# Altium project STM32MP15XXAD_LPDDR2x16.PrjPcb
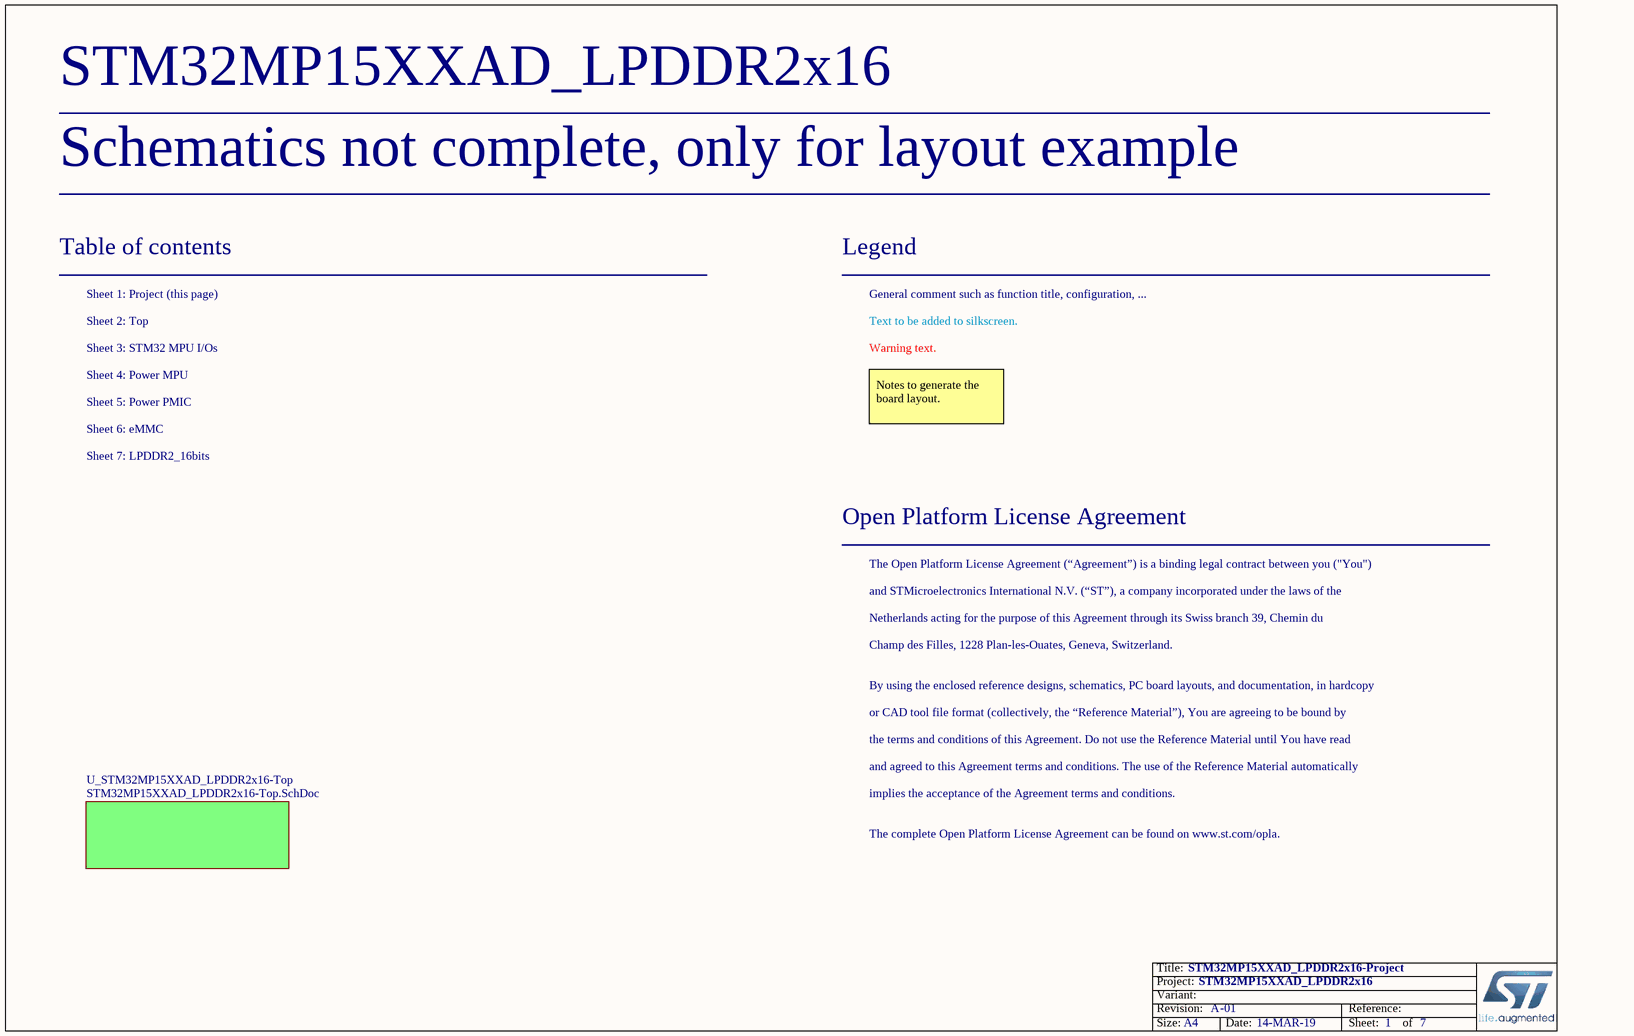
[diagram p0: STM32MP15XXAD_LPDDR2x16-Project.SchDoc]
Board_Assembly_Revision: 01; Board_Document_Date: 14-MAR-19; Board_Name: STM32MP15XXAD_LPDDR2x16; Board_PCB_Revision: A
7 sheets, 88 parts. Net scope: flat (ports and power ports of the same name join across sheets).
Board file: STM32MP15XXAD_1LPDDR2x16_A01.PcbDoc
Sheets:
  STM32MP15XXAD_LPDDR2x16-Project.SchDoc
    U_STM32MP15XXAD_LPDDR2x16-Top = STM32MP15XXAD_LPDDR2x16-Top.SchDoc
      U_Power_PMIC = Power_PMIC.SchDoc
      U_Power_MPU = Power_MPU.SchDoc
      U_eMMC = eMMC.SchDoc
      U_STM32_MPU_IOs = STM32_MPU_IOs.SchDoc
      U_LPDDR2_16bits = LPDDR2_16bits .SchDoc

## Sheet STM32MP15XXAD_LPDDR2x16-Project.SchDoc: STM32MP15XXAD_LPDDR2x16-Project
size A4; ApprovedBy: Not used; CheckedBy: Not used; Author: Not used; CompanyName: STMicroelectronics; DrawnBy: Not used; Engineer: Not used; Organization: Not used; Address1: Not used; Address2: Not used; Address3: Not used; Address4: Not used; DocumentNumber: Not used; Revision: Not used; SheetNumber: 1; SheetTotal: 7; CurrentTime: Not used; CurrentDate: Not used; Time: Not used; DocumentFullPathAndName: Not used; DocumentName: Not used; ModifiedDate: Not used; ImagePath: Not used; ProjectName: Not used; Application_BuildNumber: Not used

### Sub-sheets
U_STM32MP15XXAD_LPDDR2x16-Top = STM32MP15XXAD_LPDDR2x16-Top.SchDoc: no entries

### Notes on the sheet
- Schematics not complete, only for layout example
- Table of contents
- Sheet 1: Project (this page)
- Legend
- General comment such as function title, configuration, ...
- Sheet 2: Top
- Sheet 3: STM32 MPU I/Os
- Sheet 4: Power MPU
- Text to be added to silkscreen.
- Warning text.
- Sheet 5: Power PMIC
- Sheet 6: eMMC
- Notes to generate the board layout.
- Sheet 7: LPDDR2_16bits
- Open Platform License Agreement
- The Open Platform License Agreement (“Agreement”) is a binding legal contract between you ("You")
- and STMicroelectronics International N.V. (“ST”), a company incorporated under the laws of the
- Netherlands acting for the purpose of this Agreement through its Swiss branch 39, Chemin du
- Champ des Filles, 1228 Plan-les-Ouates, Geneva, Switzerland.
- By using the enclosed reference designs, schematics, PC board layouts, and documentation, in hardcopy
- or CAD tool file format (collectively, the “Reference Material”), You are agreeing to be bound by
- the terms and conditions of this Agreement. Do not use the Reference Material until You have read
- and agreed to this Agreement terms and conditions. The use of the Reference Material automatically
- implies the acceptance of the Agreement terms and conditions.
- The complete Open Platform License Agreement can be found on www.st.com/opla.
- Title:
- Project:
- Size:
- Revision:
- Variant:
- A4
- -
- Date:
- Reference:
- Sheet:
- of

## Sheet STM32MP15XXAD_LPDDR2x16-Top.SchDoc: STM32MP15XXAD_LPDDR2x16-TOP
size A4; Date: Not used; ApprovedBy: Not used; CheckedBy: Not used; Author: Not used; CompanyName: STMicroelectronics; DrawnBy: Not used; Engineer: Not used; Organization: Not used; Address1: Not used; Address2: Not used; Address3: Not used; Address4: Not used; DocumentNumber: Not used; Revision: Not used; SheetNumber: 2; SheetTotal: 7; CurrentTime: Not used; CurrentDate: Not used; Time: Not used; DocumentFullPathAndName: Not used; DocumentName: Not used; ModifiedDate: Not used; ImagePath: Not used; ProjectName: Not used; Application_BuildNumber: Not used
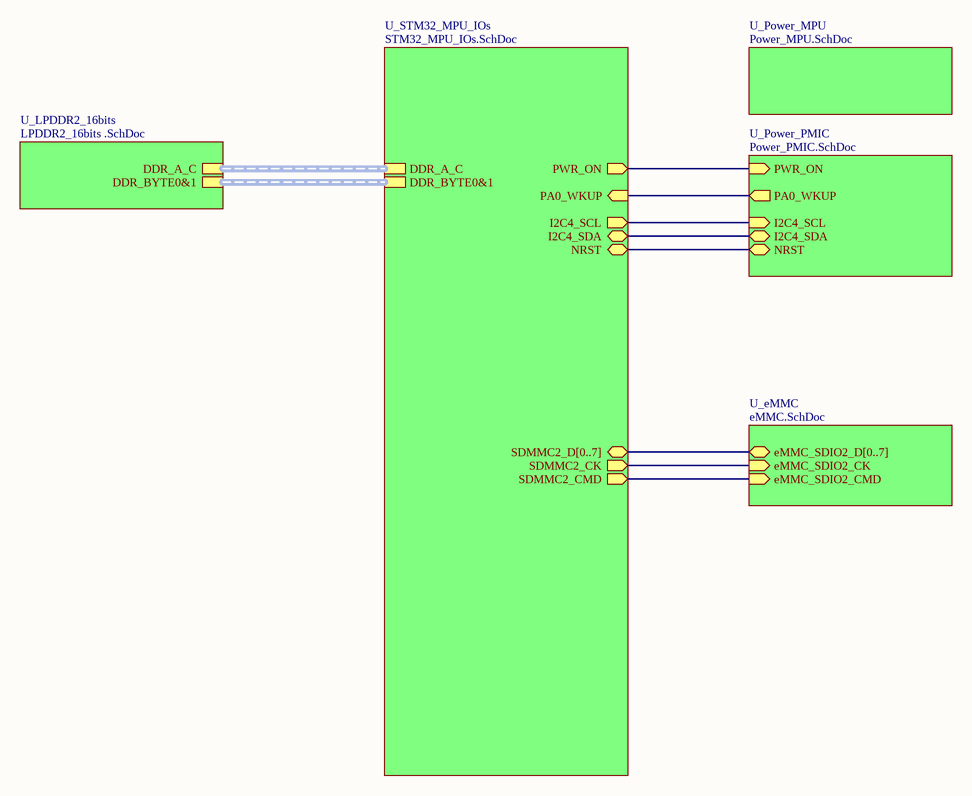
[diagram p1: STM32MP15XXAD_LPDDR2x16-Top.SchDoc]

### Sub-sheets
U_eMMC = eMMC.SchDoc: eMMC_SDIO2_CK (in), eMMC_SDIO2_D[0..7] (bidir), eMMC_SDIO2_CMD (in)
U_LPDDR2_16bits = LPDDR2_16bits .SchDoc: DDR_A_C (harness DDR_A_C), DDR_BYTE0&1 (harness DDR_BYTE_0&1)
U_Power_MPU = Power_MPU.SchDoc: no entries
U_Power_PMIC = Power_PMIC.SchDoc: I2C4_SDA (bidir), I2C4_SCL (in), PA0_WKUP (out), NRST (bidir), PWR_ON (in)
U_STM32_MPU_IOs = STM32_MPU_IOs.SchDoc: PA0_WKUP (in), NRST (bidir), PWR_ON (out), I2C4_SCL (out), I2C4_SDA (bidir), DDR_BYTE0&1 (harness DDR_BYTE_0&1), DDR_A_C (harness DDR_A_C), SDMMC2_D[0..7] (bidir), SDMMC2_CMD (out), SDMMC2_CK (out)

### Nets
(unnamed): sheet U_Power_PMIC/I2C4_SDA, sheet U_STM32_MPU_IOs/I2C4_SDA
(unnamed): sheet U_Power_PMIC/I2C4_SCL, sheet U_STM32_MPU_IOs/I2C4_SCL
(unnamed): sheet U_Power_PMIC/PA0_WKUP, sheet U_STM32_MPU_IOs/PA0_WKUP
(unnamed): sheet U_Power_PMIC/NRST, sheet U_STM32_MPU_IOs/NRST
(unnamed): sheet U_Power_PMIC/PWR_ON, sheet U_STM32_MPU_IOs/PWR_ON
(unnamed): sheet U_eMMC/eMMC_SDIO2_CK, sheet U_STM32_MPU_IOs/SDMMC2_CK
(unnamed): sheet U_eMMC/eMMC_SDIO2_CMD, sheet U_STM32_MPU_IOs/SDMMC2_CMD

### Buses and harness runs
bus sheet U_eMMC/eMMC_SDIO2_D[0..7] = sheet U_STM32_MPU_IOs/SDMMC2_D[0..7]
harness sheet U_LPDDR2_16bits/DDR_A_C = sheet U_STM32_MPU_IOs/DDR_A_C
harness sheet U_LPDDR2_16bits/DDR_BYTE0&1 = sheet U_STM32_MPU_IOs/DDR_BYTE0&1

### Notes on the sheet
- Title:
- Project:
- Size:
- Revision:
- Variant:
- A4
- -
- Date:
- Reference:
- Sheet:
- of

## Sheet Power_PMIC.SchDoc: Power_PMIC
size A3; CompanyName: STMicroelectronics; Organization: Microcontrollers Division; Address1: 12, Rue Jules HOROWITZ; Address2: 38019 Grenoble; Address3: FRANCE; SheetNumber: 5; SheetTotal: 7
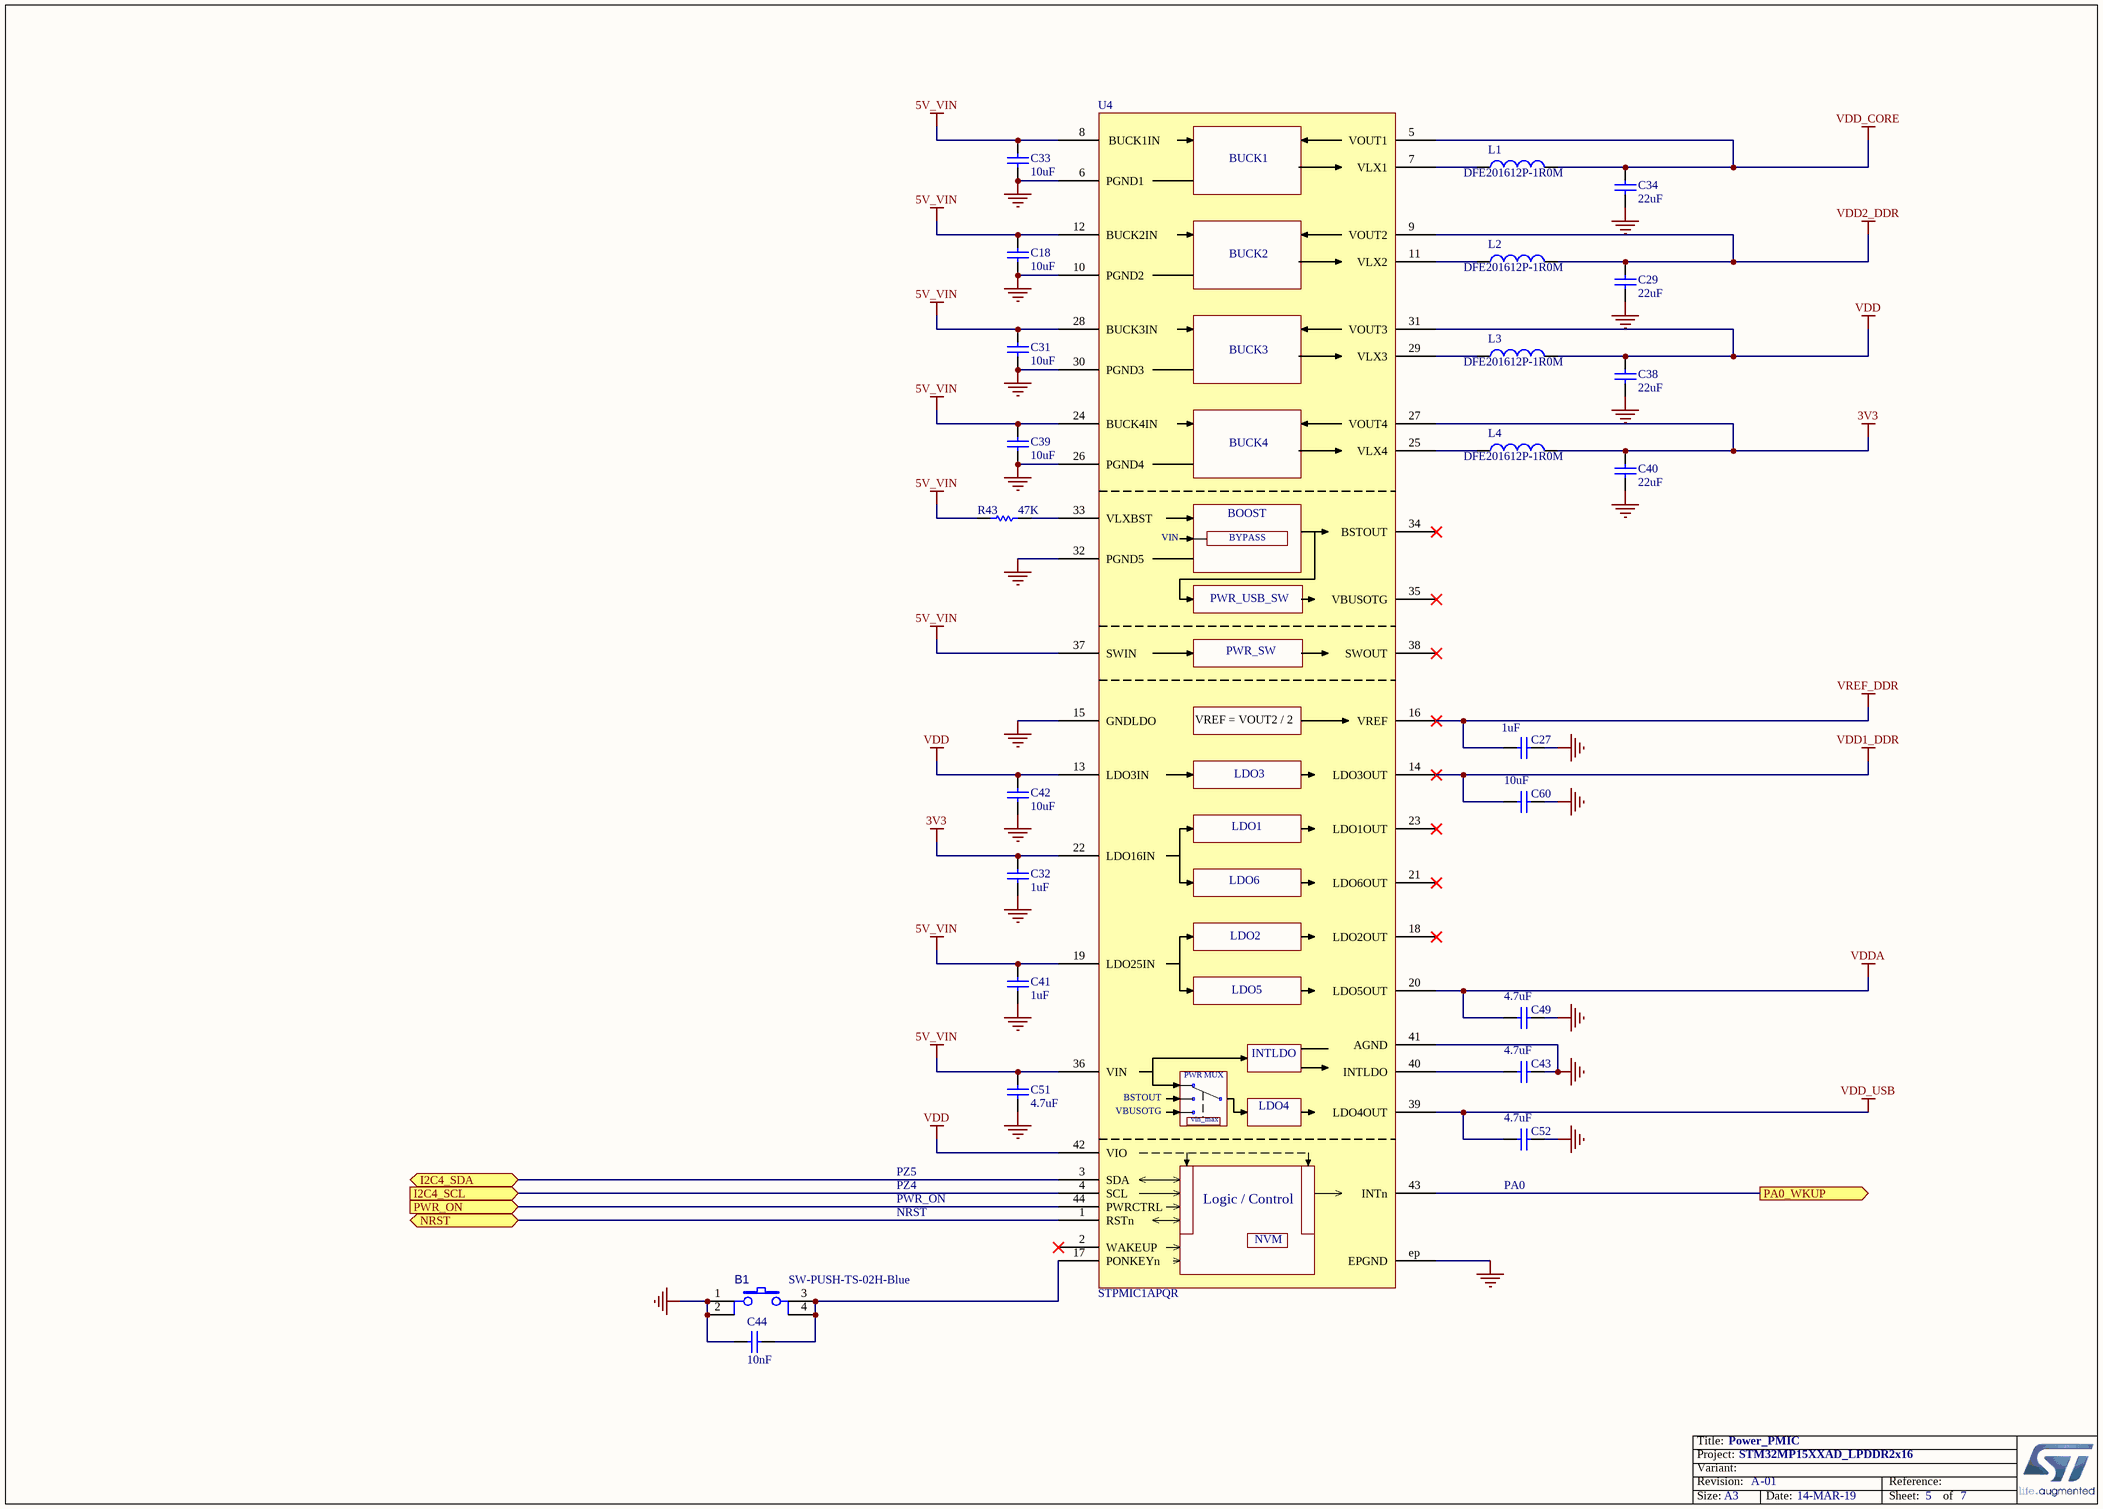
[diagram p2: Power_PMIC.SchDoc]

### Parts
B1  value SW-PUSH-TS-02H-Blue  [SWI_JIUBABA_C-TS-02H-2-5-B-V-T_R_BLUE]
C18  value 10uF  [C0603]
C27  value 1uF  [C0402]
C29  value 22uF  [C0603]
C31  value 10uF  [C0603]
C32  value 1uF  [C0402]
C33  value 10uF  [C0603]
C34  value 22uF  [C0603]
C38  value 22uF  [C0603]
C39  value 10uF  [C0603]
C40  value 22uF  [C0603]
C41  value 1uF  [C0402]
C42  value 10uF  [C0603]
C43  value 4.7uF  [C0402]
C44  value 10nF  [C0402]
C49  value 4.7uF  [C0402]
C51  value 4.7uF  [C0402]
C52  value 4.7uF  [C0402]
C60  value 10uF  [C0603]
L1  value DFE201612P-1R0M  [IND_MURATA_DFE201612P]
L2  value DFE201612P-1R0M  [IND_MURATA_DFE201612P]
L3  value DFE201612P-1R0M  [IND_MURATA_DFE201612P]
L4  value DFE201612P-1R0M  [IND_MURATA_DFE201612P]
R43  value 47K  [R0402]
U4  value STPMIC1APQR  [ICC_WFQFN44-EPAD_5X6_P040]

### Ports
I2C4_SCL (in), I2C4_SDA (bidir), NRST (bidir), PA0_WKUP (out), PWR_ON (in)

### Nets
3V3: C32.2 C40.2 L4.2 U4.22(LDO16IN) U4.27(VOUT4)
5V_VIN: C18.2 C31.2 C33.2 C39.2 C41.2 C51.1 R43.2 U4.8(BUCK1IN) U4.12(BUCK2IN) U4.19(LDO25IN) U4.24(BUCK4IN) U4.28(BUCK3IN) U4.36(VIN) U4.37(SWIN)
GND: B1.1 B1.2 C18.1 C27.1 C29.1 C31.1 C32.1 C33.1 C34.1 C38.1 C39.1 C40.1 C41.1 C42.1 C43.1 C44.1 C49.1 C51.2 C52.1 C60.1 U4.6(PGND1) U4.10(PGND2) U4.15(GNDLDO) U4.26(PGND4) U4.30(PGND3) U4.32(PGND5) U4.41(AGND) U4.ep(EPGND)
VDD: C38.2 C42.2 L3.2 U4.13(LDO3IN) U4.31(VOUT3) U4.42(VIO)
VDD1_DDR: C60.2 U4.14(LDO3OUT)
VDD2_DDR: C29.2 L2.2 U4.9(VOUT2)
VDD_CORE: C34.2 L1.2 U4.5(VOUT1)
VDD_USB: C52.2 U4.39(LDO4OUT)
VDDA: C49.2 U4.20(LDO5OUT)
VREF_DDR: C27.2 U4.16(VREF)
I2C4_SCL: U4.4(SCL) ; port I2C4_SCL
I2C4_SDA: U4.3(SDA) ; port I2C4_SDA
NRST: U4.1(RSTn) ; port NRST
PA0_WKUP: U4.43(INTn) ; port PA0_WKUP
PWR_ON: U4.44(PWRCTRL) ; port PWR_ON
NetB1_3: B1.3 B1.4 C44.2 U4.17(PONKEYn)
NetC43_2: C43.2 U4.40(INTLDO)
NetL1_1: L1.1 U4.7(VLX1)
NetL2_1: L2.1 U4.11(VLX2)
NetL3_1: L3.1 U4.29(VLX3)
NetL4_1: L4.1 U4.25(VLX4)
NetR43_1: R43.1 U4.33(VLXBST)

Not connected (* = marked no-connect by the designer): U4 2(WAKEUP)* 18(LDO2OUT)* 21(LDO6OUT)* 23(LDO1OUT)* 34(BSTOUT)* 35(VBUSOTG)* 38(SWOUT)*

### Notes on the sheet
- PZ5
- PZ4
- (near C52) PA0
- PWR_ON
- NRST
- Title:
- Project:
- Size:
- Revision:
- Variant:
- A3
- -
- Date:
- Reference:
- Sheet:
- of
- (in symbol MCD-01650) BUCK1; BUCK2; BUCK3; BUCK4; BOOST; BYPASS; PWR_USB_SW; PWR_SW; VREF = VOUT2 / 2; LDO3; LDO1; LDO6; LDO2; LDO5; PWR MUX; LDO4; vin_max; Logic / Control; NVM

### Library data of the parts
B1 = MCD-00172: Switch HW SMD blue; Part_Type: Misc; Manufacturer_Part_Number: C-TS-02H-2.5-B-V-T/R BLUE; Manufacturer: JIUBABA; Provided_By: SUBCO; Internal_Part_Number: MCD-00172; Status: Checked; ComponentLink1Description: Datasheet; ComponentLink1URL: http://tunmcdsvn.tun.st.com/Component_Datasheet_Library/Trunk/Misc/Jiubaba_TS-02H-H2-5; ECCN_US: n/a; ECCN_EU: n/a
C18 C31 C33 C39 C42 C60 = MCD-00099: Capacitor, MLCC, 10uF, 10V, X5R, 10%, 0603, T=0,8mm; Manufacturer_Part_Number: GRM188R61A106KE69D; Manufacturer: MURATA; Provided_By: SUBCO; ECCN_US: EAR99; ECCN_EU: NEC; Internal_Part_Number: MCD-00099; Status: Released; Part_Type: Capacitor; Package: C0603; ComponentLink1Description: Datasheet; ComponentLink1URL: http://tunmcdsvn.tun.st.com/Component_Datasheet_Library/Trunk/Capacitors/Murata_Capacitor_GR_series
C27 C32 C41 = MCD-00095: Capacitor, MLCC, 1uF, 25V, X5R, 10%, 0402, T=0,5mm; Manufacturer_Part_Number: GRM155R61E105KA12; Manufacturer: MURATA; Alternate_Manufacturer_Part_Number: GRM155R60J105KE19; Provided_By: SUBCO; ECCN_US: EAR99; ECCN_EU: NEC; Internal_Part_Number: MCD-00095; Status: Released; Part_Type: Capacitor; Package: C0402; ComponentLink1Description: Datasheet; ComponentLink1URL: http://tunmcdsvn.tun.st.com/Component_Datasheet_Library/Trunk/Capacitors/Murata_Capacitor_GR_series; Alternate_Manufacturer: MURATA
C29 C34 C38 C40 = MCD-00100: Capacitor, MLCC, 22uF, 6V3, X5R, 20%, 0603, T=0,8mm; Manufacturer_Part_Number: GRM188R60J226MEA0J; Manufacturer: MURATA; Provided_By: SUBCO; ECCN_US: EAR99; ECCN_EU: NEC; Internal_Part_Number: MCD-00100; Status: Released; Part_Type: Capacitor; Package: C0603; ComponentLink1Description: Datasheet; ComponentLink1URL: http://tunmcdsvn.tun.st.com/Component_Datasheet_Library/Trunk/Capacitors/Murata_Capacitor_GR_series
C43 C49 C51 C52 = MCD-01356: Capacitor, MLCC, 4.7uF, 6V3, X5R, 20%, 0402, T=0,5mm; Manufacturer_Part_Number: GRM155R60J475ME47; Manufacturer: MURATA; Alternate_Manufacturer_Part_Number: GRM155R60J475ME87; Provided_By: SUBCO; ECCN_US: EAR99; ECCN_EU: NEC; Internal_Part_Number: MCD-01356; Status: Released; Part_Type: Capacitor; Package: C0402; ComponentLink1Description: Datasheet; ComponentLink1URL: http://tunmcdsvn.tun.st.com/Component_Datasheet_Library/Trunk/Capacitors/Murata_Capacitor_GR_series; Alternate_Manufacturer: MURATA
C44 = MCD-00011: Capacitor, MLCC, 10nF, 16V, X7R, 10%, 0402, T=0.5mm; Manufacturer_Part_Number: CC0402KRX7R7BB103; Manufacturer: YAGEO; Provided_By: SUBCO; ECCN_US: EAR99; ECCN_EU: NEC; Internal_Part_Number: MCD-00011; Status: Released; Part_Type: Capacitor; Package: C0402; ComponentLink1Description: Datasheet; ComponentLink1URL: http://tunmcdsvn.tun.st.com/Component_Datasheet_Library/Trunk/Capacitors/Yageo_Multilayer_Capacitor_X7R_series_100pF_to_22uF
L1-L4 = MCD-01491: Inductors 1.0uH 54mOhms3.3A +/-20% 2016; Manufacturer: MURATA; Provided_By: SUBCO; Internal_Part_Number: MCD-01491; Status: Footprint available; Part_Type: Inductor; Manufacturer_Part_Number: DFE201612P-1R0M; Package: 2016; ComponentLink1Description: Datasheet; ComponentLink1URL: http://tunmcdsvn.tun.st.com/Component_Datasheet_Library/Trunk/Inductors/Murata_Inductor_DFE201612P-1ROM/Murata_inductor_DFE201612P-1R0M.pdf; ECCN_US: n/a; ECCN_EU: n/a
R43 = MCD-00063: Resistor,47K,0402,1%,1/16W; Manufacturer_Part_Number: RC0402FR-0747KL; Manufacturer: YAGEO; Provided_By: SUBCO; ECCN_US: EAR99; ECCN_EU: NEC; Internal_Part_Number: MCD-00063; Status: Released; Part_Type: Resistor; Package: R0402; ComponentLink1Description: Datasheet; ComponentLink1URL: http://tunmcdsvn.tun.st.com/Component_Datasheet_Library/Trunk/Resistors/Yageo_Resistor_RC0402-series
U4 = MCD-01650: ST PMIC:  4 step-down + 1 advanced boost SMPS, 6 LDOs, 2 pwr switches, DDR Vref, NVM option 'A' for IO@3.3V; Part_Type: IC; Manufacturer: STMICROELECTRONICS; BMS_Part_Number: 9177723; ECCN_US: EAR99; ECCN_EU: NEC; Provided_By: SUBCO with ST control; Internal_Part_Number: MCD-01650; Status: Footprint available; Manufacturer_Part_Number: STPMIC1APQR; Package: WFQFN 5.0x6.0x0.80mm; ComponentLink1Description: Datasheet; ComponentLink1URL: http://tunmcdsvn.tun.st.com/Component_Datasheet_Library/Trunk/IC/STM_PMIC_LuftBurg_5x6_44L_20_01_2016

## Sheet Power_MPU.SchDoc: Power_MPU
size A3; CompanyName: STMicroelectronics; SheetNumber: 4; SheetTotal: 7
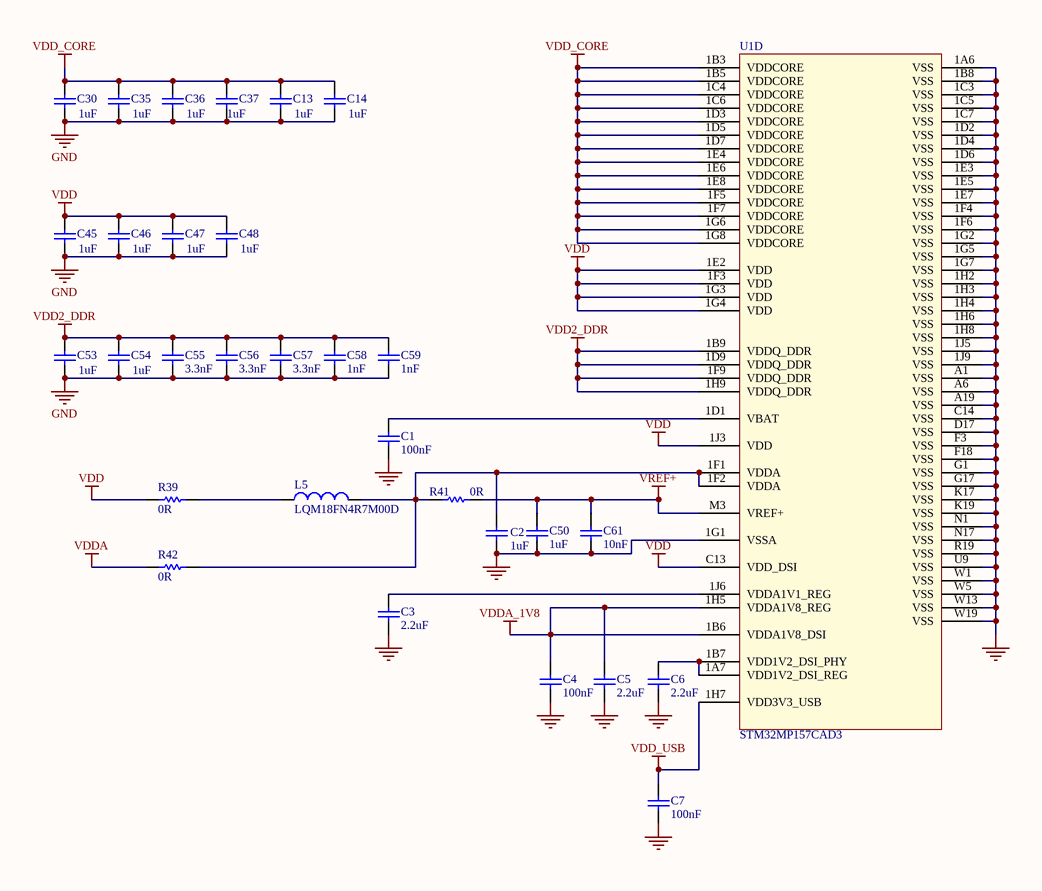
[diagram p3: Power_MPU.SchDoc]

### Parts
C1  value 100nF  [C0402]
C2  value 1uF  [C0402]
C3  value 2.2uF  [C0402]
C4  value 100nF  [C0402]
C5  value 2.2uF  [C0402]
C6  value 2.2uF  [C0402]
C7  value 100nF  [C0402]
C13  value 1uF  [C0402]
C14  value 1uF  [C0402]
C30  value 1uF  [C0402]
C35  value 1uF  [C0402]
C36  value 1uF  [C0402]
C37  value 1uF  [C0402]
C45  value 1uF  [C0402]
C46  value 1uF  [C0402]
C47  value 1uF  [C0402]
C48  value 1uF  [C0402]
C50  value 1uF  [C0402]
C53  value 1uF  [C0402]
C54  value 1uF  [C0402]
C55  value 3.3nF  [C0402]
C56  value 3.3nF  [C0402]
C57  value 3.3nF  [C0402]
C58  value 1nF  [C0402]
C59  value 1nF  [C0402]
C61  value 10nF  [C0402]
L5  value LQM18FN4R7M00D  [L0603_H0P8]
R39  value 0R  [R0402]
R41  value 0R  [R0402]
R42  value 0R  [R0402]
U1  value STM32MP157CAD3  [ICC_TFBGA257_10X10_STM32MP157CAD3_P050-065]  (part D of 5)

### Nets
GND: C1.1 C2.1 C3.1 C4.1 C5.1 C6.1 C7.1 C13.1 C14.1 C30.1 C35.1 C36.1 C37.1 C45.1 C46.1 C47.1 C48.1 C50.1 C53.1 C54.1 C55.1 C56.1 C57.1 C58.1 C59.1 C61.1 U1.1A6(VSS) U1.1B8(VSS) U1.1C3(VSS) U1.1C5(VSS) U1.1C7(VSS) U1.1D2(VSS) U1.1D4(VSS) U1.1D6(VSS) U1.1E3(VSS) U1.1E5(VSS) U1.1E7(VSS) U1.1F4(VSS) U1.1F6(VSS) U1.1G1(VSSA) U1.1G2(VSS) U1.1G5(VSS) U1.1G7(VSS) U1.1H2(VSS) U1.1H3(VSS) U1.1H4(VSS) U1.1H6(VSS) U1.1H8(VSS) U1.1J5(VSS) U1.1J9(VSS) U1.A1(VSS) U1.A6(VSS) U1.A19(VSS) U1.C14(VSS) U1.D17(VSS) U1.F3(VSS) U1.F18(VSS) U1.G1(VSS) U1.G17(VSS) U1.K17(VSS) U1.K19(VSS) U1.N1(VSS) U1.N17(VSS) U1.R19(VSS) U1.U9(VSS) U1.W1(VSS) U1.W5(VSS) U1.W13(VSS) U1.W19(VSS)
VDD: C45.2 C46.2 C47.2 C48.2 R39.1 U1.1E2(VDD) U1.1F3(VDD) U1.1G3(VDD) U1.1G4(VDD) U1.1J3(VDD) U1.C13(VDD_DSI)
VDD2_DDR: C53.2 C54.2 C55.2 C56.2 C57.2 C58.2 C59.2 U1.1B9(VDDQ_DDR) U1.1D9(VDDQ_DDR) U1.1F9(VDDQ_DDR) U1.1H9(VDDQ_DDR)
VDD_CORE: C13.2 C14.2 C30.2 C35.2 C36.2 C37.2 U1.1B3(VDDCORE) U1.1B5(VDDCORE) U1.1C4(VDDCORE) U1.1C6(VDDCORE) U1.1D3(VDDCORE) U1.1D5(VDDCORE) U1.1D7(VDDCORE) U1.1E4(VDDCORE) U1.1E6(VDDCORE) U1.1E8(VDDCORE) U1.1F5(VDDCORE) U1.1F7(VDDCORE) U1.1G6(VDDCORE) U1.1G8(VDDCORE)
VDD_USB: C7.2 U1.1H7(VDD3V3_USB)
VDDA: R42.1
VDDA_1V8: C4.2 C5.2 U1.1B6(VDDA1V8_DSI) U1.1H5(VDDA1V8_REG)
VREF+: C50.2 C61.2 R41.2 U1.M3(VREF+)
NetC1_2: C1.2 U1.1D1(VBAT)
NetC2_2: C2.2 L5.2 R41.1 R42.2 U1.1F1(VDDA) U1.1F2(VDDA)
NetC3_2: C3.2 U1.1J6(VDDA1V1_REG)
NetC6_2: C6.2 U1.1A7(VDD1V2_DSI_REG) U1.1B7(VDD1V2_DSI_PHY)
NetL5_1: L5.1 R39.2

### Notes on the sheet
- Title:
- Project:
- Size:
- Revision:
- Variant:
- A3
- -
- Date:
- Reference:
- Sheet:
- of

### Library data of the parts
C1 C4 C7 = MCD-00006: Capacitor, MLCC, 100nF, 16V, X7R, 10%, 0402, T=0.5mm; Manufacturer_Part_Number: CC0402KRX7R7BB104; Manufacturer: YAGEO; Alternate_Manufacturer_Part_Number: GCM155R71C104KA55D; Alternate_Manufacturer: MURATA; ECCN_US: EAR99; ECCN_EU: NEC; Provided_By: SUBCO; Internal_Part_Number: MCD-00006; ComponentLink1Description: Datasheet; Status: Released; Part_Type: Capacitor; Package: C0402; ComponentLink1URL: http://tunmcdsvn.tun.st.com/Component_Datasheet_Library/Trunk/Capacitors/Yageo_Multilayer_Capacitor_X7R_series_100pF_to_22uF
C2 C13 C14 C30 C35-C37 C45-C48 C50 C53 C54 = MCD-00095: Capacitor, MLCC, 1uF, 25V, X5R, 10%, 0402, T=0,5mm; Manufacturer_Part_Number: GRM155R61E105KA12; Manufacturer: MURATA; Alternate_Manufacturer_Part_Number: GRM155R60J105KE19; ECCN_US: EAR99; ECCN_EU: NEC; Provided_By: SUBCO; Internal_Part_Number: MCD-00095; Status: Released; Part_Type: Capacitor; Package: C0402; ComponentLink1Description: Datasheet; ComponentLink1URL: http://tunmcdsvn.tun.st.com/Component_Datasheet_Library/Trunk/Capacitors/Murata_Capacitor_GR_series; Alternate_Manufacturer: MURATA
C3 C5 C6 = MCD-01823: Capacitor,MLCC,2.2uF,6V3,X5R,10%,0402,T=0.5; Manufacturer_Part_Number: GRM155R60J225KE95D; Manufacturer: MURATA; ECCN_US: EAR99; ECCN_EU: NEC; Provided_By: SUBCO; Internal_Part_Number: MCD-01823; Status: Checked; Part_Type: Capacitor; Package: C0402; ComponentLink1Description: Datasheet; ComponentLink1URL: http://tunmcdsvn.tun.st.com/Component_Datasheet_Library/Trunk/Capacitors/Murata_Capacitor_GR_series
C55-C57 = MCD-01462: Capacitor, MLCC, 3.3nF, 16V, X7R, 10%, 0402, T=0.5mm; Manufacturer_Part_Number: CC0402KRX7R7BB332; Manufacturer: YAGEO; Provided_By: SUBCO; Internal_Part_Number: MCD-01462; Status: Footprint available; Part_Type: Capacitor; Package: C0402; ComponentLink1Description: Datasheet; ComponentLink1URL: http://tunmcdsvn.tun.st.com/Component_Datasheet_Library/Trunk/Capacitors/Yageo_Multilayer_Capacitor_X7R_series_100pF_to_22uF/Yageo_Mutilayer_Capacitor_X7R_100pF_to_22uF.pdf; ECCN_US: N/A; ECCN_EU: N/A
C58 C59 = MCD-00198: Capacitor, MLCC, 1nF, 16V, X7R, 10%, 0402, T=0.5mm; Manufacturer_Part_Number: CC0402KRX7R7BB102; Manufacturer: YAGEO; Provided_By: SUBCO; ECCN_US: EAR99; ECCN_EU: NEC; Internal_Part_Number: MCD-00198; Status: Released; Part_Type: Capacitor; Package: C0402; ComponentLink1Description: Datasheet; ComponentLink1URL: http://tunmcdsvn.tun.st.com/Component_Datasheet_Library/Trunk/Capacitors/Yageo_Multilayer_Capacitor_X7R_series_100pF_to_22uF
C61 = MCD-00011: Capacitor, MLCC, 10nF, 16V, X7R, 10%, 0402, T=0.5mm; Manufacturer_Part_Number: CC0402KRX7R7BB103; Manufacturer: YAGEO; ECCN_US: EAR99; ECCN_EU: NEC; Provided_By: SUBCO; Internal_Part_Number: MCD-00011; Status: Released; Part_Type: Capacitor; Package: C0402; ComponentLink1Description: Datasheet; ComponentLink1URL: http://tunmcdsvn.tun.st.com/Component_Datasheet_Library/Trunk/Capacitors/Yageo_Multilayer_Capacitor_X7R_series_100pF_to_22uF
L5 = MCD-01134: IND 4.7uH 20% 80mA 600mhom 0603; Part_Type: Inductor; Manufacturer: MURATA; Provided_By: SUBCO; Internal_Part_Number: MCD-01134; Status: Footprint available; Manufacturer_Part_Number: LQM18FN4R7M00D; Package: 0603; ComponentLink1Description: Datasheet; ComponentLink1URL: http://tunmcdsvn.tun.st.com/Component_Datasheet_Library/Trunk/Inductors/Murata_inductor_LQM18FN4R7M00D; ECCN_US: n/a; ECCN_EU: n/a
R39 R42 = MCD-00052: Resistor,0R,0402,5%,1/16W; Manufacturer_Part_Number: RC0402JR-070RL; Manufacturer: YAGEO; Provided_By: SUBCO; ECCN_US: EAR99; ECCN_EU: NEC; Internal_Part_Number: MCD-00052; Status: Released; Part_Type: Resistor; Package: R0402; ComponentLink1Description: Datasheet; ComponentLink1URL: http://tunmcdsvn.tun.st.com/Component_Datasheet_Library/Trunk/Resistors/Yageo_Resistor_RC0402-series
R41 = MCD-00052: Resistor,0R,0402,5%,1/16W; Manufacturer_Part_Number: RC0402JR-070RL; Manufacturer: YAGEO; ECCN_US: EAR99; ECCN_EU: NEC; Provided_By: SUBCO; Internal_Part_Number: MCD-00052; Status: Released; Part_Type: Resistor; ComponentLink1Description: Datasheet; ComponentLink1URL: http://tunmcdsvn.tun.st.com/Component_Datasheet_Library/Trunk/Resistors/Yageo_Resistor_RC0402-series; Package: R0402
U1 = MCD-01144: MPU TFBGA10x10 secure boot+crypto; Part_Type: IC; Manufacturer: STMICROELECTRONICS; Provided_By: SUBCO with ST control; ECCN_US: 5A002A4; Internal_Part_Number: MCD-01144; Status: Footprint available; Manufacturer_Part_Number: STM32MP157CAD3; ComponentLink1Description: Datasheet; ComponentLink1URL: http://TBD; ECCN_EU: 5A002A4

## Sheet eMMC.SchDoc: eMMC
size A3; CompanyName: STMicroelectronics; Address1: 12, Rue Jules HOROWITZ; Address2: 38019 Grenoble; Address3: FRANCE; SheetNumber: 6; SheetTotal: 7
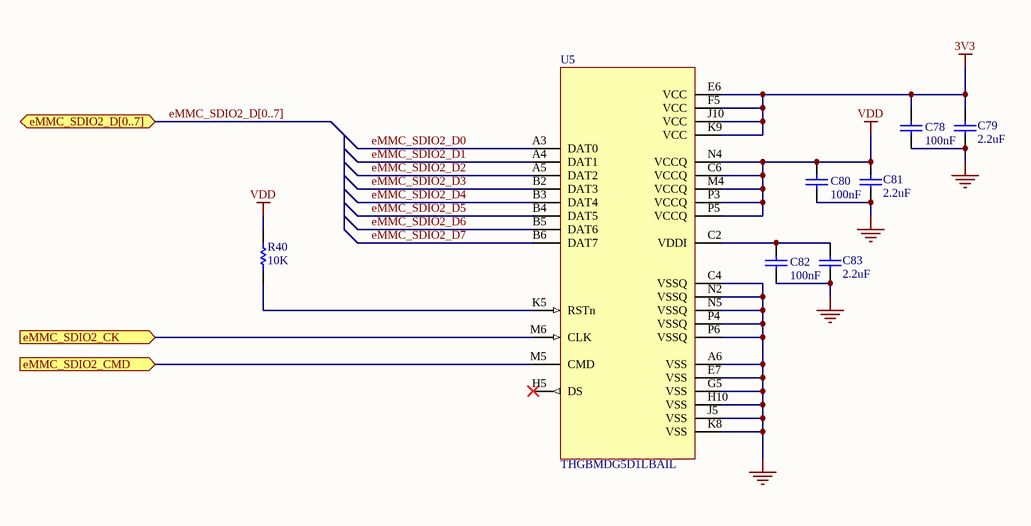
[diagram p4: eMMC.SchDoc]

### Parts
C78  value 100nF  [C0402]
C79  value 2.2uF  [C0603]
C80  value 100nF  [C0402]
C81  value 2.2uF  [C0603]
C82  value 100nF  [C0402]
C83  value 2.2uF  [C0603]
R40  value 10K  [R0402]
U5  value THGBMDG5D1LBAIL  [ICC_P-WFBGA153_13X11P5_P050]

### Ports
eMMC_SDIO2_CK (in), eMMC_SDIO2_CMD (in), eMMC_SDIO2_D[0..7] (bidir)

### Nets
3V3: C78.2 C79.2 U5.E6(VCC) U5.F5(VCC) U5.J10(VCC) U5.K9(VCC)
GND: C78.1 C79.1 C80.1 C81.1 C82.1 C83.1 U5.A6(VSS) U5.C4(VSSQ) U5.E7(VSS) U5.G5(VSS) U5.H10(VSS) U5.J5(VSS) U5.K8(VSS) U5.N2(VSSQ) U5.N5(VSSQ) U5.P4(VSSQ) U5.P6(VSSQ)
VDD: C80.2 C81.2 R40.2 U5.C6(VCCQ) U5.M4(VCCQ) U5.N4(VCCQ) U5.P3(VCCQ) U5.P5(VCCQ)
eMMC_SDIO2_CK: U5.M6(CLK) ; port eMMC_SDIO2_CK
eMMC_SDIO2_CMD: U5.M5(CMD) ; port eMMC_SDIO2_CMD
eMMC_SDIO2_D0: U5.A3(DAT0)
eMMC_SDIO2_D1: U5.A4(DAT1)
eMMC_SDIO2_D2: U5.A5(DAT2)
eMMC_SDIO2_D3: U5.B2(DAT3)
eMMC_SDIO2_D4: U5.B3(DAT4)
eMMC_SDIO2_D5: U5.B4(DAT5)
eMMC_SDIO2_D6: U5.B5(DAT6)
eMMC_SDIO2_D7: U5.B6(DAT7)
NetC82_2: C82.2 C83.2 U5.C2(VDDI)
NetR40_1: R40.1 U5.K5(RSTn)

Not connected (* = marked no-connect by the designer): U5 H5(DS)*

### Buses and harness runs
bus eMMC_SDIO2_D[0..7] = port eMMC_SDIO2_D[0..7]

### Notes on the sheet
- Title:
- Project:
- Size:
- Revision:
- Variant:
- A3
- -
- Date:
- Reference:
- Sheet:
- of

### Library data of the parts
C78 C80 C82 = MCD-00006: Capacitor, MLCC, 100nF, 16V, X7R, 10%, 0402, T=0.5mm; Manufacturer_Part_Number: CC0402KRX7R7BB104; Manufacturer: YAGEO; Alternate_Manufacturer_Part_Number: GCM155R71C104KA55D; Alternate_Manufacturer: MURATA; Provided_By: SUBCO; ECCN_US: EAR99; ECCN_EU: NEC; Internal_Part_Number: MCD-00006; Status: Released; Part_Type: Capacitor; Package: C0402; ComponentLink1Description: Datasheet; ComponentLink1URL: http://tunmcdsvn.tun.st.com/Component_Datasheet_Library/Trunk/Capacitors/Yageo_Multilayer_Capacitor_X7R_series_100pF_to_22uF
C79 C81 C83 = MCD-00012: Capacitor, MLCC, 2.2uF, 10V, X5R, 10%, 0603, T=0,8mm; Manufacturer_Part_Number: CC0603KRX5R6BB225; Manufacturer: YAGEO; Alternate_Manufacturer_Part_Number: C0603C225K8PACTU; Alternate_Manufacturer: KEMET; BMS_Part_Number: 9142010; Provided_By: SUBCO; ECCN_US: EAR99; ECCN_EU: NEC; Internal_Part_Number: MCD-00012; Status: Released; Part_Type: Capacitor; Package: C0603; ComponentLink1Description: Datasheet; ComponentLink1URL: http://tunmcdsvn.tun.st.com/Component_Datasheet_Library/Trunk/Capacitors/Yageo_Multilayer_capacitor_X5R_series_100pF_to_100uF
R40 = MCD-00053: Resistor,10K,0402,1%,1/16W; Manufacturer_Part_Number: RC0402FR-0710KL; Manufacturer: YAGEO; BMS_Part_Number: 9131590; Provided_By: SUBCO; ECCN_US: EAR99; ECCN_EU: NEC; Internal_Part_Number: MCD-00053; Status: Released; Part_Type: Resistor; Package: R0402; ComponentLink1Description: Datasheet; ComponentLink1URL: http://tunmcdsvn.tun.st.com/Component_Datasheet_Library/Trunk/Resistors/Yageo_Resistor_RC0402-series
U5 = MCD-00110: Memory,e-MMC,4GB,3V3,WFBGA,153pins; Part_Type: IC; Manufacturer: TOSHIBA; BMS_Part_Number: 9171005; Provided_By: SUBCO; ECCN_US: 3A991; ECCN_EU: NEC; Internal_Part_Number: MCD-00110; Status: Obsolete; Manufacturer_Part_Number: THGBMDG5D1LBAIL; ComponentLink1Description: Datasheet; ComponentLink1URL: http://tunmcdsvn.tun.st.com/Component_Datasheet_Library/Trunk/IC/Toshiba_eMMC_THGBMDG5D1LBAIL_20151201

## Sheet STM32_MPU_IOs.SchDoc: MPU
size A3; SheetNumber: 3; SheetTotal: 7
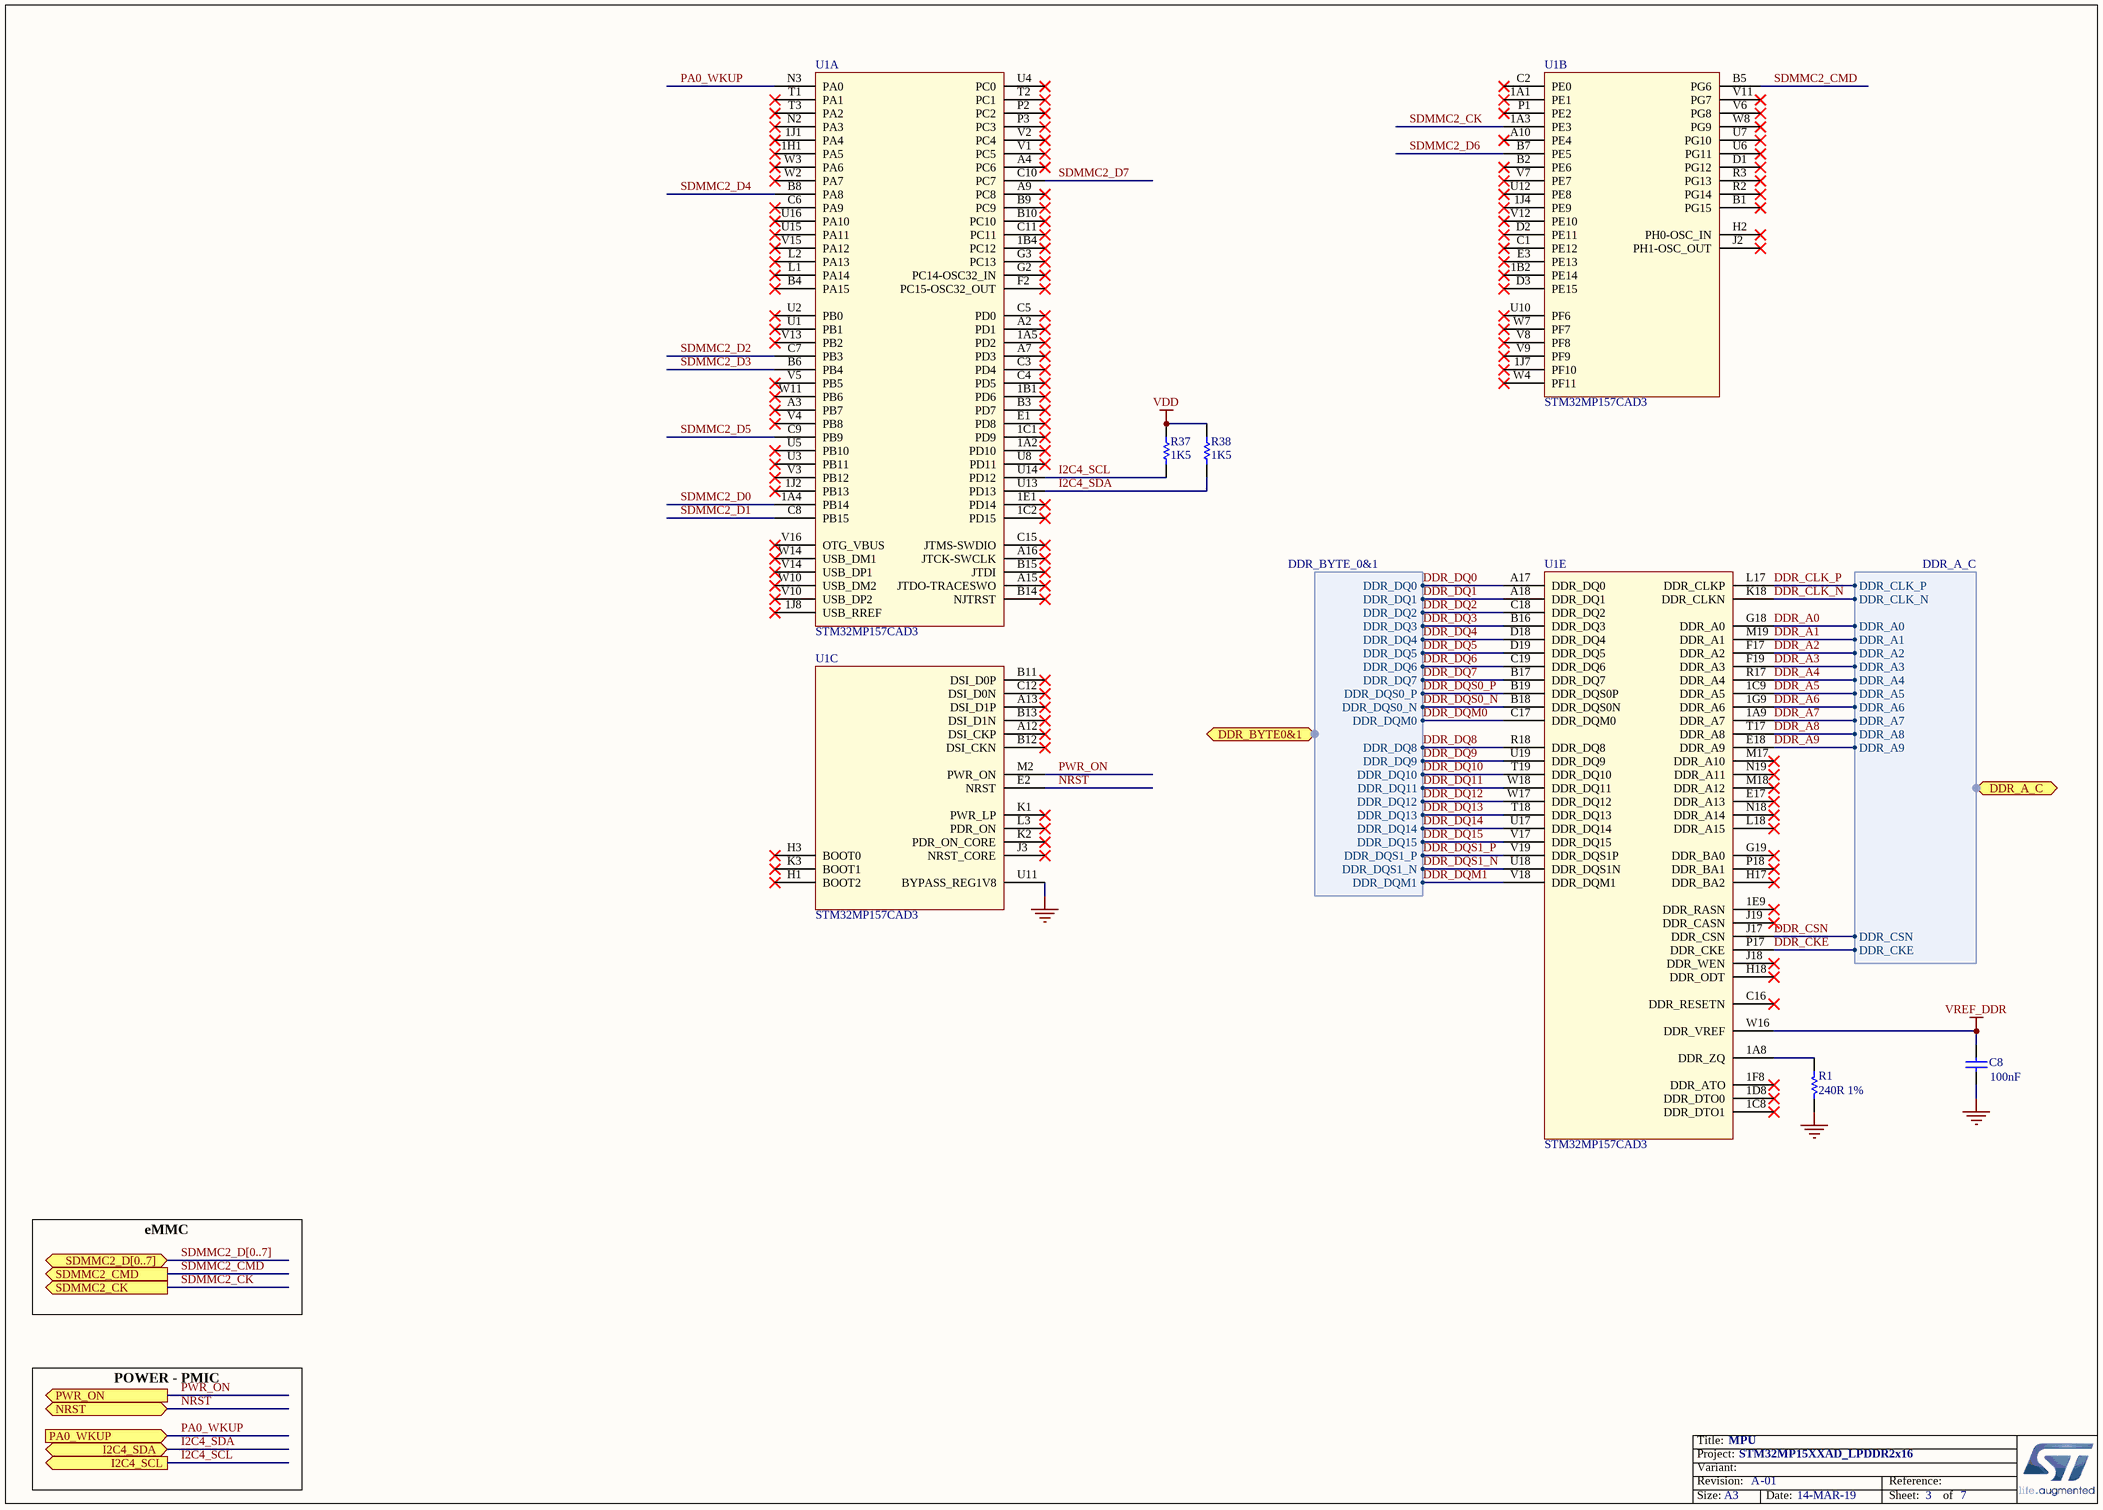
[diagram p5: STM32_MPU_IOs.SchDoc]

### Parts
C8  value 100nF  [C0402]
R1  value 240R 1%  [R0402]
R37  value 1K5  [R0402]
R38  value 1K5  [R0402]
U1  value STM32MP157CAD3  [ICC_TFBGA257_10X10_STM32MP157CAD3_P050-065]  (parts A,B,C,E of 5)

### Ports
DDR_A_C (harness DDR_A_C), DDR_BYTE0&1 (harness DDR_BYTE_0&1), I2C4_SCL (out), I2C4_SDA (bidir), NRST (bidir), PA0_WKUP (in), PWR_ON (out), SDMMC2_CK (out), SDMMC2_CMD (out), SDMMC2_D[0..7] (bidir)

### Harnesses
DDR_BYTE_0&1: DDR_DQ0, DDR_DQ1, DDR_DQ2, DDR_DQ3, DDR_DQ4, DDR_DQ5, DDR_DQ6, DDR_DQ7, DDR_DQS0_P, DDR_DQS0_N, DDR_DQM0, DDR_DQ8, DDR_DQ9, DDR_DQ10, DDR_DQ11, DDR_DQ12, DDR_DQ13, DDR_DQ14, DDR_DQ15, DDR_DQS1_P, DDR_DQS1_N, DDR_DQM1
DDR_A_C: DDR_CLK_P, DDR_CLK_N, DDR_A0, DDR_A1, DDR_A2, DDR_A3, DDR_A4, DDR_A5, DDR_A6, DDR_A7, DDR_A8, DDR_A9, DDR_CSN, DDR_CKE

### Nets
GND: C8.1 R1.2 U1.U11(BYPASS_REG1V8)
VDD: R37.1 R38.1
VREF_DDR: C8.2 U1.W16(DDR_VREF)
DDR_A0: U1.G18(DDR_A0) ; port DDR_A_C.DDR_A0
DDR_A1: U1.M19(DDR_A1) ; port DDR_A_C.DDR_A1
DDR_A2: U1.F17(DDR_A2) ; port DDR_A_C.DDR_A2
DDR_A3: U1.F19(DDR_A3) ; port DDR_A_C.DDR_A3
DDR_A4: U1.R17(DDR_A4) ; port DDR_A_C.DDR_A4
DDR_A5: U1.1C9(DDR_A5) ; port DDR_A_C.DDR_A5
DDR_A6: U1.1G9(DDR_A6) ; port DDR_A_C.DDR_A6
DDR_A7: U1.1A9(DDR_A7) ; port DDR_A_C.DDR_A7
DDR_A8: U1.T17(DDR_A8) ; port DDR_A_C.DDR_A8
DDR_A9: U1.E18(DDR_A9) ; port DDR_A_C.DDR_A9
DDR_CKE: U1.P17(DDR_CKE) ; port DDR_A_C.DDR_CKE
DDR_CLK_N: U1.K18(DDR_CLKN) ; port DDR_A_C.DDR_CLK_N
DDR_CLK_P: U1.L17(DDR_CLKP) ; port DDR_A_C.DDR_CLK_P
DDR_CSN: U1.J17(DDR_CSN) ; port DDR_A_C.DDR_CSN
DDR_DQ0: U1.A17(DDR_DQ0) ; port DDR_BYTE0&1.DDR_DQ0
DDR_DQ1: U1.A18(DDR_DQ1) ; port DDR_BYTE0&1.DDR_DQ1
DDR_DQ2: U1.C18(DDR_DQ2) ; port DDR_BYTE0&1.DDR_DQ2
DDR_DQ3: U1.B16(DDR_DQ3) ; port DDR_BYTE0&1.DDR_DQ3
DDR_DQ4: U1.D18(DDR_DQ4) ; port DDR_BYTE0&1.DDR_DQ4
DDR_DQ5: U1.D19(DDR_DQ5) ; port DDR_BYTE0&1.DDR_DQ5
DDR_DQ6: U1.C19(DDR_DQ6) ; port DDR_BYTE0&1.DDR_DQ6
DDR_DQ7: U1.B17(DDR_DQ7) ; port DDR_BYTE0&1.DDR_DQ7
DDR_DQ8: U1.R18(DDR_DQ8) ; port DDR_BYTE0&1.DDR_DQ8
DDR_DQ9: U1.U19(DDR_DQ9) ; port DDR_BYTE0&1.DDR_DQ9
DDR_DQ10: U1.T19(DDR_DQ10) ; port DDR_BYTE0&1.DDR_DQ10
DDR_DQ11: U1.W18(DDR_DQ11) ; port DDR_BYTE0&1.DDR_DQ11
DDR_DQ12: U1.W17(DDR_DQ12) ; port DDR_BYTE0&1.DDR_DQ12
DDR_DQ13: U1.T18(DDR_DQ13) ; port DDR_BYTE0&1.DDR_DQ13
DDR_DQ14: U1.U17(DDR_DQ14) ; port DDR_BYTE0&1.DDR_DQ14
DDR_DQ15: U1.V17(DDR_DQ15) ; port DDR_BYTE0&1.DDR_DQ15
DDR_DQM0: U1.C17(DDR_DQM0) ; port DDR_BYTE0&1.DDR_DQM0
DDR_DQM1: U1.V18(DDR_DQM1) ; port DDR_BYTE0&1.DDR_DQM1
DDR_DQS0_N: U1.B18(DDR_DQS0N) ; port DDR_BYTE0&1.DDR_DQS0_N
DDR_DQS0_P: U1.B19(DDR_DQS0P) ; port DDR_BYTE0&1.DDR_DQS0_P
DDR_DQS1_N: U1.U18(DDR_DQS1N) ; port DDR_BYTE0&1.DDR_DQS1_N
DDR_DQS1_P: U1.V19(DDR_DQS1P) ; port DDR_BYTE0&1.DDR_DQS1_P
I2C4_SCL: R37.2 U1.U14(PD12) ; port I2C4_SCL
I2C4_SDA: R38.2 U1.U13(PD13) ; port I2C4_SDA
NRST: U1.E2(NRST) ; port NRST
PA0_WKUP: U1.N3(PA0) ; port PA0_WKUP
PWR_ON: U1.M2(PWR_ON) ; port PWR_ON
SDMMC2_CK: U1.1A3(PE3) ; port SDMMC2_CK
SDMMC2_CMD: U1.B5(PG6) ; port SDMMC2_CMD
SDMMC2_D0: U1.1A4(PB14)
SDMMC2_D1: U1.C8(PB15)
SDMMC2_D2: U1.C7(PB3)
SDMMC2_D3: U1.B6(PB4)
SDMMC2_D4: U1.B8(PA8)
SDMMC2_D5: U1.C9(PB9)
SDMMC2_D6: U1.B7(PE5)
SDMMC2_D7: U1.C10(PC7)
NetR1_1: R1.1 U1.1A8(DDR_ZQ)

Not connected (* = marked no-connect by the designer): U1 1A1(PE1)* 1A2(PD10)* 1A5(PD2)* 1B1(PD6)* 1B2(PE14)* 1B4(PC12)* 1C1(PD9)* 1C2(PD15)* 1C8(DDR_DTO1)* 1D8(DDR_DTO0)* 1E1(PD14)* 1E9(DDR_RASN)* 1F8(DDR_ATO)* 1H1(PA5)* 1J1(PA4)* 1J2(PB13)* 1J4(PE9)* 1J7(PF10)* 1J8(USB_RREF)* A2(PD1)* A3(PB7)* A4(PC6)* A7(PD3)* A9(PC8)* A10(PE4)* A12(DSI_CKP)* A13(DSI_D1P)* A15(JTDO-TRACESWO)* A16(JTCK-SWCLK)* B1(PG15)* B2(PE6)* B3(PD7)* B4(PA15)* B9(PC9)* B10(PC10)* B11(DSI_D0P)* B12(DSI_CKN)* B13(DSI_D1N)* B14(NJTRST)* B15(JTDI)* C1(PE12)* C2(PE0)* C3(PD4)* C4(PD5)* C5(PD0)* C6(PA9)* C11(PC11)* C12(DSI_D0N)* C15(JTMS-SWDIO)* C16(DDR_RESETN)* D1(PG12)* D2(PE11)* D3(PE15)* E1(PD8)* E3(PE13)* E17(DDR_A13)* F2(PC15-OSC32_OUT)* G2(PC14-OSC32_IN)* G3(PC13)* G19(DDR_BA0)* H1(BOOT2)* H2(PH0-OSC_IN)* H3(BOOT0)* H17(DDR_BA2)* H18(DDR_ODT)* J2(PH1-OSC_OUT)* J3(NRST_CORE)* J18(DDR_WEN)* J19(DDR_CASN)* K1(PWR_LP)* K2(PDR_ON_CORE)* K3(BOOT1)* L1(PA14)* L2(PA13)* L3(PDR_ON)* L18(DDR_A15)* M17(DDR_A10)* M18(DDR_A12)* N2(PA3)* N18(DDR_A14)* N19(DDR_A11)* P1(PE2)* P2(PC2)* P3(PC3)* P18(DDR_BA1)* R2(PG14)* R3(PG13)* T1(PA1)* T2(PC1)* T3(PA2)* U1(PB1)* U2(PB0)* U3(PB11)* U4(PC0)* U5(PB10)* U6(PG11)* U7(PG10)* U8(PD11)* U10(PF6)* U12(PE8)* U15(PA11)* U16(PA10)* V1(PC5)* V2(PC4)* V3(PB12)* V4(PB8)* V5(PB5)* V6(PG8)* V7(PE7)* V8(PF8)* V9(PF9)* V10(USB_DP2)* V11(PG7)* V12(PE10)* V13(PB2)* V14(USB_DP1)* V15(PA12)* V16(OTG_VBUS)* W2(PA7)* W3(PA6)* W4(PF11)* W7(PF7)* W8(PG9)* W10(USB_DM2)* W11(PB6)* W14(USB_DM1)*

### Buses and harness runs
bus SDMMC2_D[0..7] = port SDMMC2_D[0..7]

### Notes on the sheet
- eMMC
- POWER - PMIC
- Title:
- Project:
- Size:
- Revision:
- Variant:
- A3
- -
- Date:
- Reference:
- Sheet:
- of

### Library data of the parts
C8 = MCD-00006: as C1 on sheet Power_MPU; Internal_Part_Number: MCD-00006; ComponentLink1Description: Datasheet; Status: Released; Part_Type: Capacitor; Package: C0402; ComponentLink1URL: http://tunmcdsvn.tun.st.com/Component_Datasheet_Library/Trunk/Capacitors/Yageo_Multilayer_Capacitor_X7R_series_100pF_to_22uF
R1 = MCD-00120: Resistor,240R,0402,1%,1/16W; Manufacturer_Part_Number: RC0402FR-07240RL; Manufacturer: YAGEO; ECCN_US: EAR99; ECCN_EU: NEC; Provided_By: SUBCO; Internal_Part_Number: MCD-00120; ComponentLink1Description: Datasheet; Status: Released; Part_Type: Resistor; ComponentLink1URL: http://tunmcdsvn.tun.st.com/Component_Datasheet_Library/Trunk/Resistors/Yageo_Resistor_RC0402-series; Package: R0402
R37 R38 = MCD-00068: Resistor,1K5,0402,1%,1/16W; Manufacturer_Part_Number: RC0402FR-071K5L; Manufacturer: YAGEO; ECCN_US: EAR99; ECCN_EU: NEC; Provided_By: SUBCO; Internal_Part_Number: MCD-00068; ComponentLink1Description: Datasheet; Status: Released; Part_Type: Resistor; ComponentLink1URL: http://tunmcdsvn.tun.st.com/Component_Datasheet_Library/Trunk/Resistors/Yageo_Resistor_RC0402-series; Package: R0402
U1 = MCD-01144: as U1 on sheet Power_MPU; Internal_Part_Number: MCD-01144; Status: Footprint available; Manufacturer_Part_Number: STM32MP157CAD3; ComponentLink1Description: Datasheet; ComponentLink1URL: http://TBD; ECCN_EU: 5A002A4

## Sheet LPDDR2_16bits .SchDoc: LPDDR2_16bits
size A3; Date: Not used; ApprovedBy: Not used; CheckedBy: Not used; Author: Not used; CompanyName: STMicroelectronics; DrawnBy: Not used; Engineer: Not used; Organization: Not used; Address1: Not used; Address2: Not used; Address3: Not used; Address4: Not used; DocumentNumber: Not used; Revision: Not used; SheetNumber: 7; SheetTotal: 7; CurrentTime: Not used; CurrentDate: Not used; Time: Not used; DocumentFullPathAndName: Not used; DocumentName: Not used; ModifiedDate: Not used; ImagePath: Not used; Application_BuildNumber: Not used
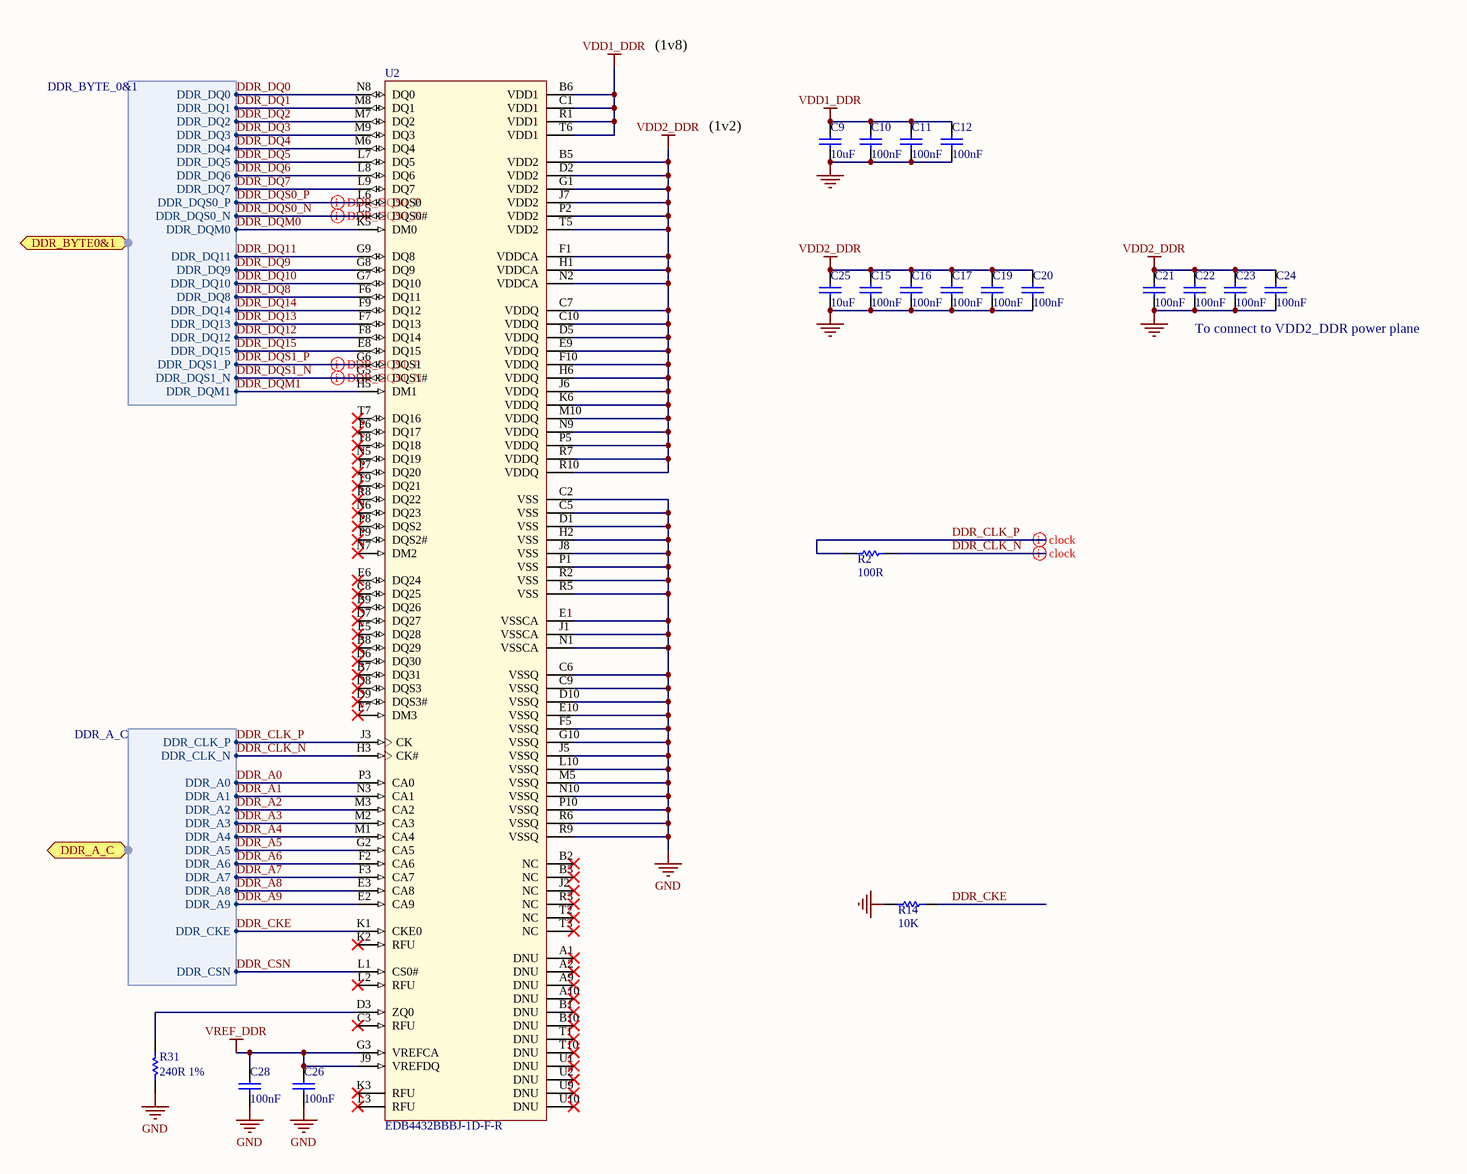
[diagram p6: LPDDR2_16bits .SchDoc]

### Parts
C9  value 10uF  [C0603]
C10  value 100nF  [C0402]
C11  value 100nF  [C0402]
C12  value 100nF  [C0402]
C15  value 100nF  [C0402]
C16  value 100nF  [C0402]
C17  value 100nF  [C0402]
C19  value 100nF  [C0402]
C20  value 100nF  [C0402]
C21  value 100nF  [C0402]
C22  value 100nF  [C0402]
C23  value 100nF  [C0402]
C24  value 100nF  [C0402]
C25  value 10uF  [C0603]
C26  value 100nF  [C0402]
C28  value 100nF  [C0402]
R2  value 100R  [R0402]
R14  value 10K  [R0402]
R31  value 240R 1%  [R0402]
U2  value EDB4432BBBJ-1D-F-R  [ICC_WFBGA134_SDP-SAC302_10X11P5_P065]

### Ports
DDR_A_C (harness DDR_A_C), DDR_BYTE0&1 (harness DDR_BYTE_0&1)

### Harnesses
DDR_BYTE_0&1: DDR_DQ0, DDR_DQ1, DDR_DQ2, DDR_DQ3, DDR_DQ4, DDR_DQ5, DDR_DQ6, DDR_DQ7, DDR_DQS0_P, DDR_DQS0_N, DDR_DQM0, DDR_DQ11, DDR_DQ9, DDR_DQ10, DDR_DQ8, DDR_DQ14, DDR_DQ13, DDR_DQ12, DDR_DQ15, DDR_DQS1_P, DDR_DQS1_N, DDR_DQM1
DDR_A_C: DDR_CLK_P, DDR_CLK_N, DDR_A0, DDR_A1, DDR_A2, DDR_A3, DDR_A4, DDR_A5, DDR_A6, DDR_A7, DDR_A8, DDR_A9, DDR_CSN, DDR_CKE

### Nets
GND: C9.1 C10.2 C11.2 C12.2 C15.2 C16.2 C17.2 C19.2 C20.2 C21.2 C22.2 C23.2 C24.2 C25.1 C26.2 C28.2 R14.1 R31.2 U2.C2(VSS) U2.C5(VSS) U2.C6(VSSQ) U2.C9(VSSQ) U2.D1(VSS) U2.D10(VSSQ) U2.E1(VSSCA) U2.E10(VSSQ) U2.F5(VSSQ) U2.G10(VSSQ) U2.H2(VSS) U2.J1(VSSCA) U2.J5(VSSQ) U2.J8(VSS) U2.L10(VSSQ) U2.M5(VSSQ) U2.N1(VSSCA) U2.N10(VSSQ) U2.P1(VSS) U2.P10(VSSQ) U2.R2(VSS) U2.R5(VSS) U2.R6(VSSQ) U2.R9(VSSQ)
VDD1_DDR: C9.2 C10.1 C11.1 C12.1 U2.B6(VDD1) U2.C1(VDD1) U2.R1(VDD1) U2.T6(VDD1)
VDD2_DDR: C15.1 C16.1 C17.1 C19.1 C20.1 C21.1 C22.1 C23.1 C24.1 C25.2 U2.B5(VDD2) U2.C7(VDDQ) U2.C10(VDDQ) U2.D2(VDD2) U2.D5(VDDQ) U2.E9(VDDQ) U2.F1(VDDCA) U2.F10(VDDQ) U2.G1(VDD2) U2.H1(VDDCA) U2.H6(VDDQ) U2.J6(VDDQ) U2.J7(VDD2) U2.K6(VDDQ) U2.M10(VDDQ) U2.N2(VDDCA) U2.N9(VDDQ) U2.P2(VDD2) U2.P5(VDDQ) U2.R7(VDDQ) U2.R10(VDDQ) U2.T5(VDD2)
VREF_DDR: C26.1 C28.1 U2.G3(VREFCA) U2.J9(VREFDQ)
DDR_A0: U2.P3(CA0) ; port DDR_A_C.DDR_A0
DDR_A1: U2.N3(CA1) ; port DDR_A_C.DDR_A1
DDR_A2: U2.M3(CA2) ; port DDR_A_C.DDR_A2
DDR_A3: U2.M2(CA3) ; port DDR_A_C.DDR_A3
DDR_A4: U2.M1(CA4) ; port DDR_A_C.DDR_A4
DDR_A5: U2.G2(CA5) ; port DDR_A_C.DDR_A5
DDR_A6: U2.F2(CA6) ; port DDR_A_C.DDR_A6
DDR_A7: U2.F3(CA7) ; port DDR_A_C.DDR_A7
DDR_A8: U2.E3(CA8) ; port DDR_A_C.DDR_A8
DDR_A9: U2.E2(CA9) ; port DDR_A_C.DDR_A9
DDR_CKE: R14.2 U2.K1(CKE0) ; port DDR_A_C.DDR_CKE
DDR_CLK_N: R2.2 U2.H3(CK#) ; port DDR_A_C.DDR_CLK_N
DDR_CLK_P: R2.1 U2.J3(CK) ; port DDR_A_C.DDR_CLK_P
DDR_CSN: U2.L1(CS0#) ; port DDR_A_C.DDR_CSN
DDR_DQ0: U2.N8(DQ0) ; port DDR_BYTE0&1.DDR_DQ0
DDR_DQ1: U2.M8(DQ1) ; port DDR_BYTE0&1.DDR_DQ1
DDR_DQ2: U2.M7(DQ2) ; port DDR_BYTE0&1.DDR_DQ2
DDR_DQ3: U2.M9(DQ3) ; port DDR_BYTE0&1.DDR_DQ3
DDR_DQ4: U2.M6(DQ4) ; port DDR_BYTE0&1.DDR_DQ4
DDR_DQ5: U2.L7(DQ5) ; port DDR_BYTE0&1.DDR_DQ5
DDR_DQ6: U2.L8(DQ6) ; port DDR_BYTE0&1.DDR_DQ6
DDR_DQ7: U2.L9(DQ7) ; port DDR_BYTE0&1.DDR_DQ7
DDR_DQ8: U2.F6(DQ11) ; port DDR_BYTE0&1.DDR_DQ8
DDR_DQ9: U2.G8(DQ9) ; port DDR_BYTE0&1.DDR_DQ9
DDR_DQ10: U2.G7(DQ10) ; port DDR_BYTE0&1.DDR_DQ10
DDR_DQ11: U2.G9(DQ8) ; port DDR_BYTE0&1.DDR_DQ11
DDR_DQ12: U2.F8(DQ14) ; port DDR_BYTE0&1.DDR_DQ12
DDR_DQ13: U2.F7(DQ13) ; port DDR_BYTE0&1.DDR_DQ13
DDR_DQ14: U2.F9(DQ12) ; port DDR_BYTE0&1.DDR_DQ14
DDR_DQ15: U2.E8(DQ15) ; port DDR_BYTE0&1.DDR_DQ15
DDR_DQM0: U2.K5(DM0) ; port DDR_BYTE0&1.DDR_DQM0
DDR_DQM1: U2.H5(DM1) ; port DDR_BYTE0&1.DDR_DQM1
DDR_DQS0_N: U2.L5(DQS0#) ; port DDR_BYTE0&1.DDR_DQS0_N
DDR_DQS0_P: U2.L6(DQS0) ; port DDR_BYTE0&1.DDR_DQS0_P
DDR_DQS1_N: U2.G5(DQS1#) ; port DDR_BYTE0&1.DDR_DQS1_N
DDR_DQS1_P: U2.G6(DQS1) ; port DDR_BYTE0&1.DDR_DQS1_P
NetR31_1: R31.1 U2.D3(ZQ0)

Not connected (* = marked no-connect by the designer): U2 A1(DNU)* A2(DNU)* A9(DNU)* A10(DNU)* B1(DNU)* B2(NC)* B3(NC)* B7(DQ31)* B8(DQ29)* B9(DQ26)* B10(DNU)* C3(RFU)* C8(DQ25)* D6(DQ30)* D7(DQ27)* D8(DQS3)* D9(DQS3#)* E5(DQ28)* E6(DQ24)* E7(DM3)* J2(NC)* K2(RFU)* K3(RFU)* L2(RFU)* L3(RFU)* N5(DQ19)* N6(DQ23)* N7(DM2)* P6(DQ17)* P7(DQ20)* P8(DQS2)* P9(DQS2#)* R3(NC)* R8(DQ22)* T1(DNU)* T2(NC)* T3(NC)* T7(DQ16)* T8(DQ18)* T9(DQ21)* T10(DNU)* U1(DNU)* U2(DNU)* U9(DNU)* U10(DNU)*

### Layout directives
differential pair: DDR_CLK_N, DDR_CLK_P, DDR_DQS0_N, DDR_DQS0_P, DDR_DQS1_N, DDR_DQS1_P

### Notes on the sheet
- (1v8)
- (1v2)
- To connect to VDD2_DDR power plane
- Title:
- Project:
- Size:
- Revision:
- Variant:
- A3
- -
- Date:
- Reference:
- Sheet:
- of

### Library data of the parts
C9 C25 = MCD-01124: Capacitor, MLCC, 10uF, 10V, X5R, 10%, 0603, T=0.8mm; Manufacturer_Part_Number: GRM188R61A106KAAL; Manufacturer: MURATA; Provided_By: SUBCO; ECCN_US: EAR99; ECCN_EU: NEC; Internal_Part_Number: MCD-01124; Status: Released; Part_Type: Capacitor; Package: C0603; ComponentLink1Description: Datasheet; ComponentLink1URL: http://tunmcdsvn.tun.st.com/Component_Datasheet_Library/Trunk/Capacitors/Murata_Capacitor_GR_series
C10-C12 C15-C17 C19-C24 C26 C28 = MCD-00006: as C78 on sheet eMMC; Internal_Part_Number: MCD-00006; Status: Released; Part_Type: Capacitor; Package: C0402; ComponentLink1Description: Datasheet; ComponentLink1URL: http://tunmcdsvn.tun.st.com/Component_Datasheet_Library/Trunk/Capacitors/Yageo_Multilayer_Capacitor_X7R_series_100pF_to_22uF
R2 = MCD-00067: Resistor,100R,0402,1%,1/16W; Manufacturer_Part_Number: RC0402FR-07100RL; Manufacturer: YAGEO; Provided_By: SUBCO; ECCN_US: EAR99; ECCN_EU: NEC; Internal_Part_Number: MCD-00067; Status: Released; Part_Type: Resistor; Package: R0402; ComponentLink1Description: Datasheet; ComponentLink1URL: http://tunmcdsvn.tun.st.com/Component_Datasheet_Library/Trunk/Resistors/Yageo_Resistor_RC0402-series
R14 = MCD-00053: as R40 on sheet eMMC; Internal_Part_Number: MCD-00053; Status: Released; Part_Type: Resistor; Package: R0402; ComponentLink1Description: Datasheet; ComponentLink1URL: http://tunmcdsvn.tun.st.com/Component_Datasheet_Library/Trunk/Resistors/Yageo_Resistor_RC0402-series
R31 = MCD-00120: as R1 on sheet STM32_MPU_IOs; Internal_Part_Number: MCD-00120; ComponentLink1Description: Datasheet; Status: Released; Part_Type: Resistor; ComponentLink1URL: http://tunmcdsvn.tun.st.com/Component_Datasheet_Library/Trunk/Resistors/Yageo_Resistor_RC0402-series; Package: R0402
U2 = MCD-01223: Memory,LPDDR2,4Gb,128Mbx32,533MHz,1066Mb/s,1V8/1V2,FBGA134; Part_Type: IC; Manufacturer: MICRON; Provided_By: SUBCO; Internal_Part_Number: MCD-01223; Status: Released; Manufacturer_Part_Number: EDB4432BBBJ-1D-F-R; Package: WFBGA134 10x11.5; ComponentLink1Description: Datasheet; ComponentLink1URL: http://tunmcdsvn.tun.st.com/Component_Datasheet_Library/Trunk/IC/Micron_LPDDR2_134b_10x11.5_EDB4432BBBJ-1D-F-R; ECCN_US: n/a; ECCN_EU: n/a

## Nets that join several sheets
3V3: Power_PMIC (5 pins), eMMC (6 pins)
GND: Power_PMIC (28 pins), Power_MPU (69 pins), eMMC (17 pins), STM32_MPU_IOs (C8.1 R1.2 U1.U11), LPDDR2_16bits  (42 pins)
VDD: Power_PMIC (6 pins), Power_MPU (11 pins), eMMC (8 pins), STM32_MPU_IOs (R37.1 R38.1)
VDD1_DDR: Power_PMIC (C60.2 U4.14), LPDDR2_16bits  (8 pins)
VDD2_DDR: Power_PMIC (C29.2 L2.2 U4.9), Power_MPU (11 pins), LPDDR2_16bits  (32 pins)
VDD_CORE: Power_PMIC (C34.2 L1.2 U4.5), Power_MPU (20 pins)
VDD_USB: Power_PMIC (C52.2 U4.39), Power_MPU (C7.2 U1.1H7)
VDDA: Power_PMIC (C49.2 U4.20), Power_MPU (R42.1)
VREF_DDR: Power_PMIC (C27.2 U4.16), STM32_MPU_IOs (C8.2 U1.W16), LPDDR2_16bits  (C26.1 C28.1 U2.G3 U2.J9)
DDR_A0: STM32_MPU_IOs (U1.G18), LPDDR2_16bits  (U2.P3)
DDR_A1: STM32_MPU_IOs (U1.M19), LPDDR2_16bits  (U2.N3)
DDR_A2: STM32_MPU_IOs (U1.F17), LPDDR2_16bits  (U2.M3)
DDR_A3: STM32_MPU_IOs (U1.F19), LPDDR2_16bits  (U2.M2)
DDR_A4: STM32_MPU_IOs (U1.R17), LPDDR2_16bits  (U2.M1)
DDR_A5: STM32_MPU_IOs (U1.1C9), LPDDR2_16bits  (U2.G2)
DDR_A6: STM32_MPU_IOs (U1.1G9), LPDDR2_16bits  (U2.F2)
DDR_A7: STM32_MPU_IOs (U1.1A9), LPDDR2_16bits  (U2.F3)
DDR_A8: STM32_MPU_IOs (U1.T17), LPDDR2_16bits  (U2.E3)
DDR_A9: STM32_MPU_IOs (U1.E18), LPDDR2_16bits  (U2.E2)
DDR_CKE: STM32_MPU_IOs (U1.P17), LPDDR2_16bits  (R14.2 U2.K1)
DDR_CLK_N: STM32_MPU_IOs (U1.K18), LPDDR2_16bits  (R2.2 U2.H3)
DDR_CLK_P: STM32_MPU_IOs (U1.L17), LPDDR2_16bits  (R2.1 U2.J3)
DDR_CSN: STM32_MPU_IOs (U1.J17), LPDDR2_16bits  (U2.L1)
DDR_DQ0: STM32_MPU_IOs (U1.A17), LPDDR2_16bits  (U2.N8)
DDR_DQ1: STM32_MPU_IOs (U1.A18), LPDDR2_16bits  (U2.M8)
DDR_DQ2: STM32_MPU_IOs (U1.C18), LPDDR2_16bits  (U2.M7)
DDR_DQ3: STM32_MPU_IOs (U1.B16), LPDDR2_16bits  (U2.M9)
DDR_DQ4: STM32_MPU_IOs (U1.D18), LPDDR2_16bits  (U2.M6)
DDR_DQ5: STM32_MPU_IOs (U1.D19), LPDDR2_16bits  (U2.L7)
DDR_DQ6: STM32_MPU_IOs (U1.C19), LPDDR2_16bits  (U2.L8)
DDR_DQ7: STM32_MPU_IOs (U1.B17), LPDDR2_16bits  (U2.L9)
DDR_DQ8: STM32_MPU_IOs (U1.R18), LPDDR2_16bits  (U2.F6)
DDR_DQ9: STM32_MPU_IOs (U1.U19), LPDDR2_16bits  (U2.G8)
DDR_DQ10: STM32_MPU_IOs (U1.T19), LPDDR2_16bits  (U2.G7)
DDR_DQ11: STM32_MPU_IOs (U1.W18), LPDDR2_16bits  (U2.G9)
DDR_DQ12: STM32_MPU_IOs (U1.W17), LPDDR2_16bits  (U2.F8)
DDR_DQ13: STM32_MPU_IOs (U1.T18), LPDDR2_16bits  (U2.F7)
DDR_DQ14: STM32_MPU_IOs (U1.U17), LPDDR2_16bits  (U2.F9)
DDR_DQ15: STM32_MPU_IOs (U1.V17), LPDDR2_16bits  (U2.E8)
DDR_DQM0: STM32_MPU_IOs (U1.C17), LPDDR2_16bits  (U2.K5)
DDR_DQM1: STM32_MPU_IOs (U1.V18), LPDDR2_16bits  (U2.H5)
DDR_DQS0_N: STM32_MPU_IOs (U1.B18), LPDDR2_16bits  (U2.L5)
DDR_DQS0_P: STM32_MPU_IOs (U1.B19), LPDDR2_16bits  (U2.L6)
DDR_DQS1_N: STM32_MPU_IOs (U1.U18), LPDDR2_16bits  (U2.G5)
DDR_DQS1_P: STM32_MPU_IOs (U1.V19), LPDDR2_16bits  (U2.G6)
I2C4_SCL: Power_PMIC (U4.4), STM32_MPU_IOs (R37.2 U1.U14)
I2C4_SDA: Power_PMIC (U4.3), STM32_MPU_IOs (R38.2 U1.U13)
NRST: Power_PMIC (U4.1), STM32_MPU_IOs (U1.E2)
PA0_WKUP: Power_PMIC (U4.43), STM32_MPU_IOs (U1.N3)
PWR_ON: Power_PMIC (U4.44), STM32_MPU_IOs (U1.M2)

## Assembly variants
Example: not fitted R42